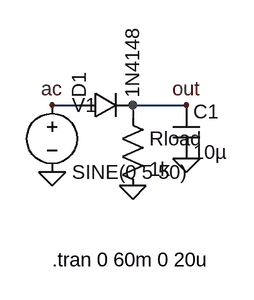
[diagram p0: schematic rectifier.asc]
rectifier.asc, the LTspice schematic file:
Version 4
SHEET 1 1600 1000
WIRE 0 16 32 16
WIRE 96 16 96 32
WIRE 96 16 160 16
FLAG 0 96 0
FLAG 96 112 0
FLAG 160 80 0
FLAG 160 16 out
FLAG 0 16 ac
SYMBOL voltage 0 0 R0
SYMATTR InstName V1
SYMATTR Value SINE(0 5 50)
SYMBOL diode 32 32 R270
SYMATTR InstName D1
SYMATTR Value 1N4148
SYMBOL res 80 16 R0
SYMATTR InstName Rload
SYMATTR Value 1k
SYMBOL cap 144 16 R0
SYMATTR InstName C1
SYMATTR Value 10µ
TEXT 0 200 Left 2 !.tran 0 60m 0 20u

The netlist it stands for:
* rectifier.asc
V1 ac 0 SINE(0 5 50)
D1 ac out 1N4148
Rload out 0 1k
C1 out 0 10µ
.model D D
.lib standard.dio
.tran 0 60m 0 20u
.backanno
.end